# EAGLE schematic schematicEagle (EAGLE 9.6.2)
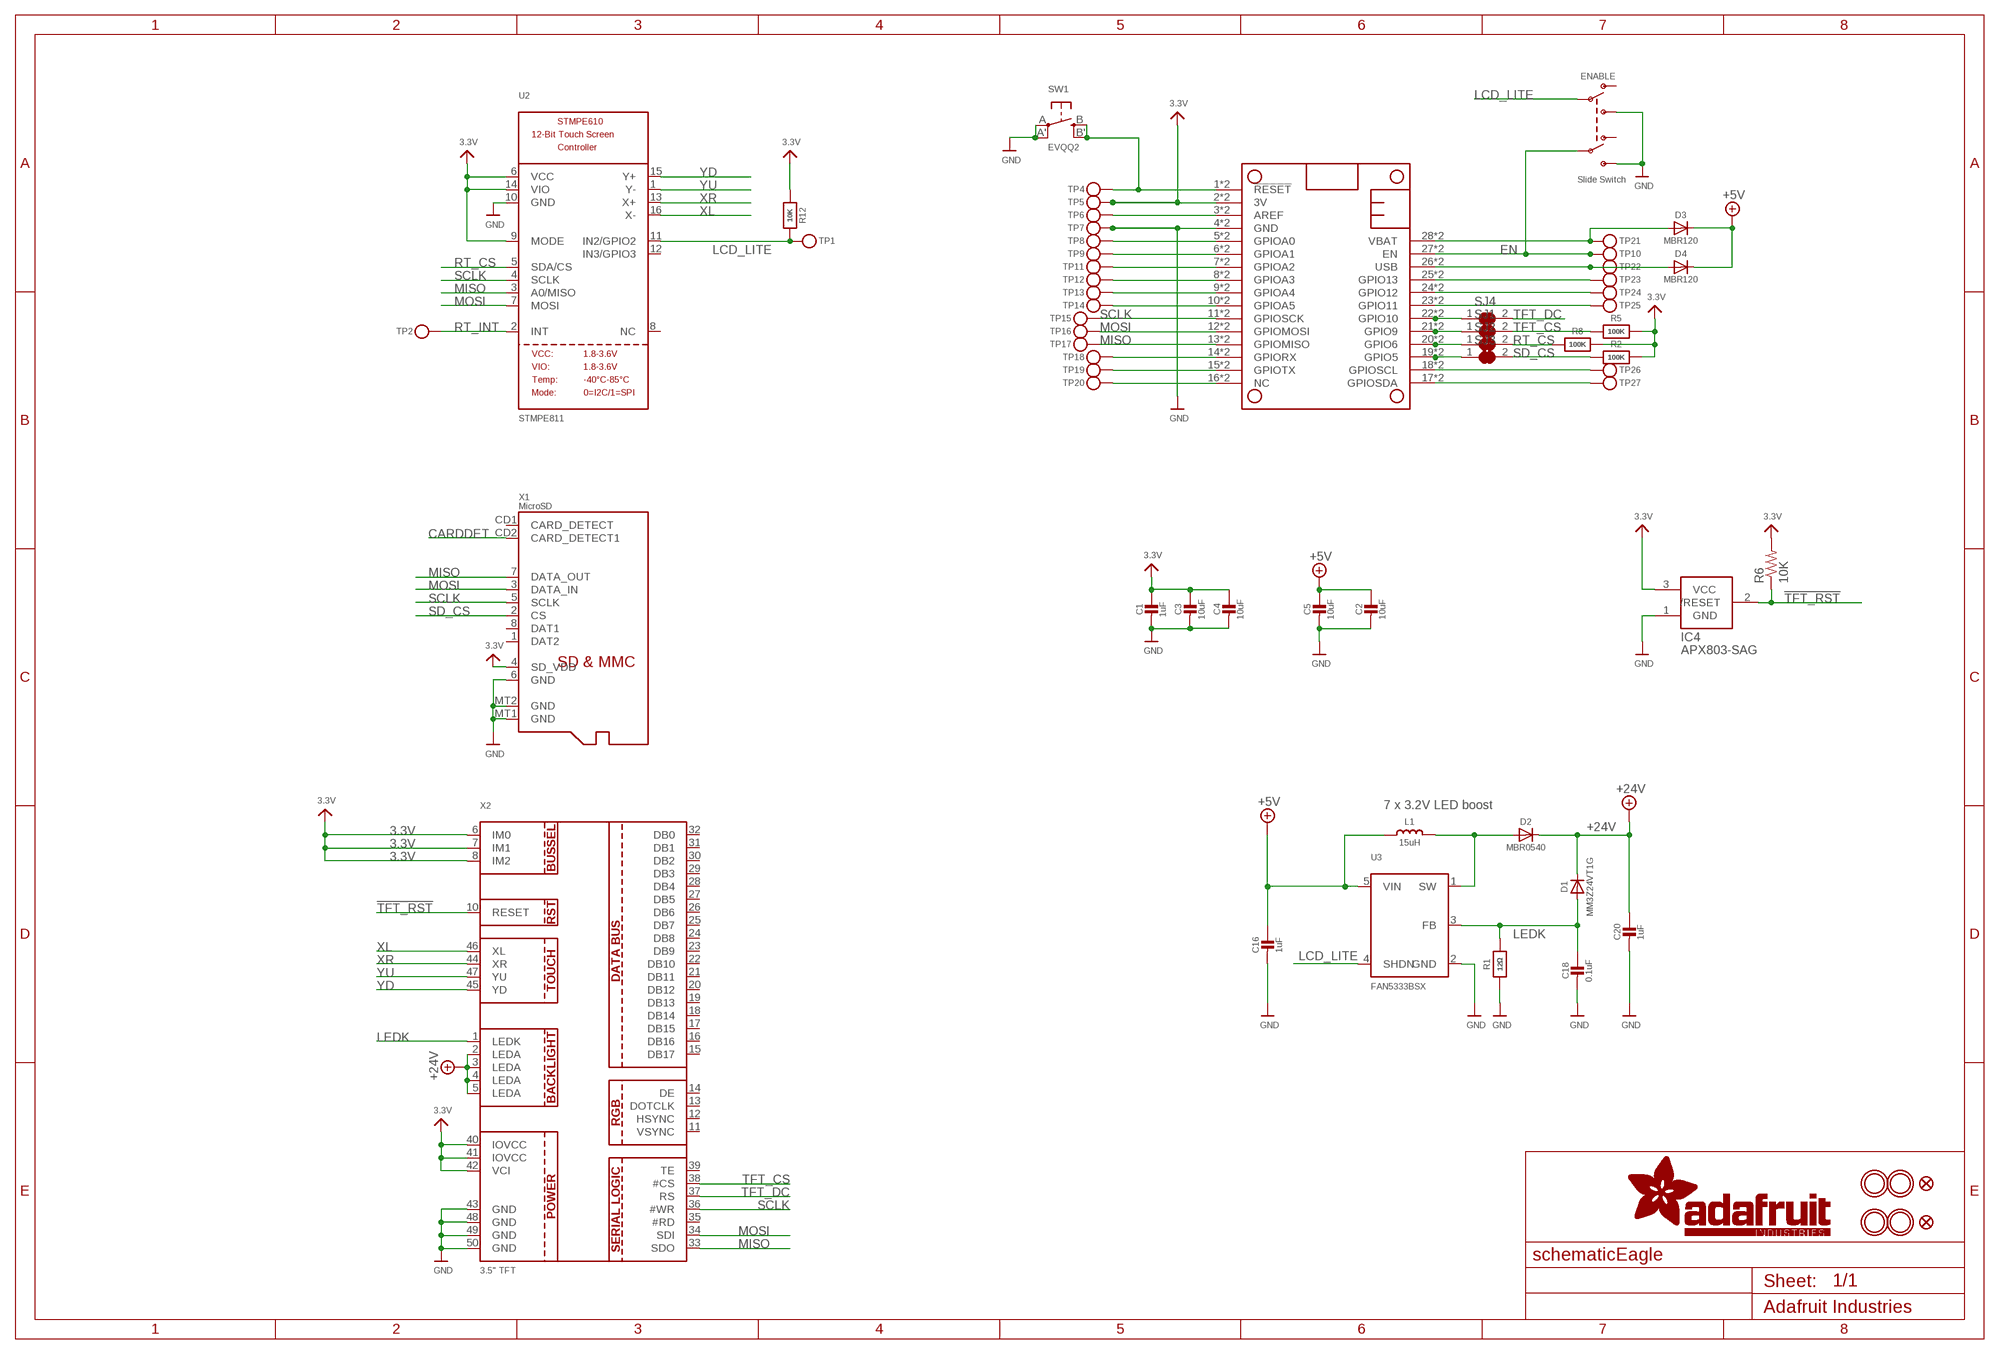
[diagram p0: schematic, sheet 1]

## Parts
C1  1uF  CAP_CERAMIC0805-NOOUTLINE  [0805-NO]
C2  10uF  CAP_CERAMIC0805-NOOUTLINE  [0805-NO]
C3  10uF  CAP_CERAMIC0805-NOOUTLINE  [0805-NO]
C4  10uF  CAP_CERAMIC0805-NOOUTLINE  [0805-NO]
C5  10uF  CAP_CERAMIC0805-NOOUTLINE  [0805-NO]
C16  1uF  CAP_CERAMIC0805-NOOUTLINE  [0805-NO]
C18  0.1uF  CAP_CERAMIC0805-NOOUTLINE  [0805-NO]
C20  1uF  CAP_CERAMIC0805-NOOUTLINE  [0805-NO]
D1  MM3Z24VT1G  DIODESMA  [SMADIODE]
D2  MBR0540  DIODESOD-123  [SOD-123]
D3  MBR120  DIODESOD-123  [SOD-123]
D4  MBR120  DIODESOD-123  [SOD-123]
ENABLE  Slide Switch  SWITCH_DPDTEG1390  [EG1390]
IC4  APX803-SAG  AXP083-SAG  [SOT23]
L1  15uH  INDUCTORNR5040  [INDUCTOR_5X5MM_NR5040_NOTHERMALS]
MS2  FEATHERWING_SMTDUAL  [FEATHERWING_SMT2]
R1  12Ω  RESISTOR0805_NOOUTLINE  [0805-NO]
R2  100K  RESISTOR0805_NOOUTLINE  [0805-NO]
R5  100K  RESISTOR0805_NOOUTLINE  [0805-NO]
R6  10K  R-US_R0805  [R0805]
R8  100K  RESISTOR0805_NOOUTLINE  [0805-NO]
R12  10K  RESISTOR0805_NOOUTLINE  [0805-NO]
SJ1  SOLDERJUMPER_CLOSED  [SOLDERJUMPER_CLOSEDWIRE]
SJ2  SOLDERJUMPER_CLOSED  [SOLDERJUMPER_CLOSEDWIRE]
SJ3  SOLDERJUMPER_CLOSED  [SOLDERJUMPER_CLOSEDWIRE]
SJ4  SOLDERJUMPER_CLOSED  [SOLDERJUMPER_CLOSEDWIRE]
SW1  EVQQ2  SWITCH_TACT_SMT_EVQQ2_SMALL  [EVQ-Q2_SMALLER]
TP1  TESTPOINTPAD2MM  [TESTPOINT_PAD_2MM]
TP2  TESTPOINTPAD2MM  [TESTPOINT_PAD_2MM]
TP4  TESTPOINTPAD2MM  [TESTPOINT_PAD_2MM]
TP5  TESTPOINTPAD2MM  [TESTPOINT_PAD_2MM]
TP6  TESTPOINTPAD2MM  [TESTPOINT_PAD_2MM]
TP7  TESTPOINTPAD2MM  [TESTPOINT_PAD_2MM]
TP8  TESTPOINTPAD2MM  [TESTPOINT_PAD_2MM]
TP9  TESTPOINTPAD2MM  [TESTPOINT_PAD_2MM]
TP10  TESTPOINTPAD2MM  [TESTPOINT_PAD_2MM]
TP11  TESTPOINTPAD2MM  [TESTPOINT_PAD_2MM]
TP12  TESTPOINTPAD2MM  [TESTPOINT_PAD_2MM]
TP13  TESTPOINTPAD2MM  [TESTPOINT_PAD_2MM]
TP14  TESTPOINTPAD2MM  [TESTPOINT_PAD_2MM]
TP15  TESTPOINTPAD2MM  [TESTPOINT_PAD_2MM]
TP16  TESTPOINTPAD2MM  [TESTPOINT_PAD_2MM]
TP17  TESTPOINTPAD2MM  [TESTPOINT_PAD_2MM]
TP18  TESTPOINTPAD2MM  [TESTPOINT_PAD_2MM]
TP19  TESTPOINTPAD2MM  [TESTPOINT_PAD_2MM]
TP20  TESTPOINTPAD2MM  [TESTPOINT_PAD_2MM]
TP21  TESTPOINTPAD2MM  [TESTPOINT_PAD_2MM]
TP22  TESTPOINTPAD2MM  [TESTPOINT_PAD_2MM]
TP23  TESTPOINTPAD2MM  [TESTPOINT_PAD_2MM]
TP24  TESTPOINTPAD2MM  [TESTPOINT_PAD_2MM]
TP25  TESTPOINTPAD2MM  [TESTPOINT_PAD_2MM]
TP26  TESTPOINTPAD2MM  [TESTPOINT_PAD_2MM]
TP27  TESTPOINTPAD2MM  [TESTPOINT_PAD_2MM]
U2  STMPE811  STMPE610  [QFN16_3MM]
U3  FAN5333BSX  FAN5331  [SOT23-5@1]
U$7  MOUNTINGHOLE3.0THIN  [MOUNTINGHOLE_3.0_PLATEDTHIN]
U$9  FIDUCIAL_1MM  [FIDUCIAL_1MM]
U$15  MOUNTINGHOLE3.0THIN  [MOUNTINGHOLE_3.0_PLATEDTHIN]
U$16  MOUNTINGHOLE3.0THIN  [MOUNTINGHOLE_3.0_PLATEDTHIN]
U$17  MOUNTINGHOLE3.0THIN  [MOUNTINGHOLE_3.0_PLATEDTHIN]
U$23  FIDUCIAL_1MM  [FIDUCIAL_1MM]
X1  MicroSD  MICROSD  [MICROSD]
X2  3.5" TFT  DISP_LCD_3.5IN_320X480_50PIN  [TFT_3.5IN_320X480_50PIN]

## Nets
3.3V: C1.1 C3.1 C4.1 IC4.3(VCC) MS2.2'(3V) MS2.2(3V) R2.2 R5.2 R6.2 R8.2 R12.1 TP5.P$1 U2.6(VCC) U2.9(MODE) U2.14(VIO) X1.4(SD_VDD) X2.6(IM0) X2.7(IM1) X2.8(IM2) X2.40(IOVCC) X2.41(IOVCC) X2.42(VCI)
!RESET: MS2.1'(!RESET) MS2.1(!RESET) SW1.B'(S1) SW1.B(S) TP4.P$1
!TFT_RST: IC4.2(/RESET) R6.1 X2.10(RESET)
+5V: C2.1 C5.1 C16.1 D3.C D4.C L1.P$1 U3.5(VIN)
+24V: C20.1 D1.C D2.C X2.2(LEDA) X2.3(LEDA) X2.4(LEDA) X2.5(LEDA)
A: MS2.5'(GPIOA0) MS2.5(GPIOA0) TP8.P$1
AREF: MS2.3'(AREF) MS2.3(AREF) TP6.P$1
B: MS2.6'(GPIOA1) MS2.6(GPIOA1) TP9.P$1
C: MS2.7'(GPIOA2) MS2.7(GPIOA2) TP11.P$1
CARDDET: X1.CD2(CARD_DETECT1)
D: MS2.8'(GPIOA3) MS2.8(GPIOA3) TP12.P$1
E: MS2.9'(GPIOA4) MS2.9(GPIOA4) TP13.P$1
EN: ENABLE.P2 MS2.27'(EN) MS2.27(EN) TP10.P$1
F: MS2.10'(GPIOA5) MS2.10(GPIOA5) TP14.P$1
G: MS2.16'(NC) MS2.16(NC) TP20.P$1
GND: C1.2 C2.2 C3.2 C4.2 C5.2 C16.2 C18.2 C20.2 ENABLE.S1 ENABLE.S2 IC4.1(GND) MS2.4'(GND) MS2.4(GND) R1.1 SW1.A'(P1) SW1.A(P) TP7.P$1 U2.10(GND) U3.2(GND) X1.6(GND) X1.MT1(GND) X1.MT2(GND) X2.43(GND) X2.48(GND) X2.49(GND) X2.50(GND)
H: MS2.19'(GPIO5) MS2.19(GPIO5) SJ3.1
I: MS2.20'(GPIO6) MS2.20(GPIO6) SJ2.1
J: MS2.21'(GPIO9) MS2.21(GPIO9) SJ1.1
K: MS2.22'(GPIO10) MS2.22(GPIO10) SJ4.1
L: MS2.23'(GPIO11) MS2.23(GPIO11) TP25.P$1
LCD_LITE: ENABLE.P1 R12.2 TP1.P$1 U2.11(IN2/GPIO2) U3.4(SHDN)
LEDK: C18.1 D1.A R1.2 U3.3(FB) X2.1(LEDK)
M: MS2.24'(GPIO12) MS2.24(GPIO12) TP24.P$1
MISO: MS2.13'(GPIOMISO) MS2.13(GPIOMISO) TP17.P$1 U2.3(A0/MISO) X1.7(DATA_OUT) X2.33(SDO)
MOSI: MS2.12'(GPIOMOSI) MS2.12(GPIOMOSI) TP16.P$1 U2.7(MOSI) X1.3(DATA_IN) X2.34(SDI)
N: MS2.25'(GPIO13) MS2.25(GPIO13) TP23.P$1
N$3: D2.A L1.P$2 U3.1(SW)
RT_CS: R8.1 SJ2.2 U2.5(SDA/CS)
RT_INT: TP2.P$1 U2.2(INT)
RX: MS2.14'(GPIORX) MS2.14(GPIORX) TP18.P$1
SCL: MS2.18'(GPIOSCL) MS2.18(GPIOSCL) TP26.P$1
SCLK: MS2.11'(GPIOSCK) MS2.11(GPIOSCK) TP15.P$1 U2.4(SCLK) X1.5(SCLK) X2.36(#WR)
SD_CS: R2.1 SJ3.2 X1.2(CS)
SDA: MS2.17'(GPIOSDA) MS2.17(GPIOSDA) TP27.P$1
TFT_CS: R5.1 SJ1.2 X2.38(#CS)
TFT_DC: SJ4.2 X2.37(RS)
TX: MS2.15'(GPIOTX) MS2.15(GPIOTX) TP19.P$1
USB: D4.A MS2.26'(USB) MS2.26(USB) TP22.P$1
VBAT: D3.A MS2.28'(VBAT) MS2.28(VBAT) TP21.P$1
XL: U2.16(X-) X2.46(XL)
XR: U2.13(X+) X2.44(XR)
YD: U2.15(Y+) X2.45(YD)
YU: U2.1(Y-) X2.47(YU)
Unconnected: ENABLE.O1 ENABLE.O2 U2.8(NC) U2.12(IN3/GPIO3) X1.1(DAT2) X1.8(DAT1) X1.CD1(CARD_DETECT) X2.11(VSYNC) X2.12(HSYNC) X2.13(DOTCLK) X2.14(DE) X2.15(DB17) X2.16(DB16) X2.17(DB15) X2.18(DB14) X2.19(DB13) X2.20(DB12) X2.21(DB11) X2.22(DB10) X2.23(DB9) X2.24(DB8) X2.25(DB7) X2.26(DB6) X2.27(DB5) X2.28(DB4) X2.29(DB3) X2.30(DB2) X2.31(DB1) X2.32(DB0) X2.35(#RD) X2.39(TE)

## Notes on the sheet
- 7 x 3.2V LED boost

## Library data of the parts
C1-C5 C16 C18 C20 = microbuilder:CAP_CERAMIC: Ceramic Capacitors For new designs, use the packages preceded by an '_' character since they are more reliable: The following footprints should be used on most boards: _0402 - Standard footprint for regular board layouts _0603 - Standard footprint for regular board layouts _0805 - Standard footprint for regular board layouts _1206 - Standard footprint for regular board layouts For extremely tight-pitch boards where space is at a premium, the following 'micro-pitch' footprints can be used (smaller pads, no silkscreen outline, etc.): _0402MP - Micro-pitch footprint for very dense/compact boards _0603MP - Micro-pitch footprint for very dense/compact boards _0805MP - Micro-pitch footprint for very dense/compact boards _1206MP - Micro-pitch footprint for very dense/compact boards
D1-D4 = microbuilder:DIODE: Diode SMA Model Volts Amps Type Vf Ir Digikey # Notes SSA34-E3 40V 3A Schottky 480mV @ 3A 200uA @ 40V SSA34-E3/61TGITR-ND CDBA120-G 20V 1A Schottky 500mV @ 1A 500uA @ 20V 641-1014-6-ND REEL MBRA210 10V 2A Schottky 350mV @ 2A 700uA @ 10V MBRA210LT3 SOD-123 Model Volts Amps Type Vf Ir Order # Notes BAT54T1G 30V 200mA Schottky 800mV @ 200mA 2uA @ 25V BAT54T1GOSTR-ND B0530W 30V 500mA Schottky 430mV @ 500mA 130uA @ 30V B0530W-FDICT-ND REEL MBR120 20V 1A Schottky 340mV @ 1A MBR120VLSFT1GOSCT-ND SOD-323 Model Volts Amps Type Vf Ir Order # Notes PMEG2005EJ 20V 500mA Schottky 355mV @ 500mA 568-4110-1-ND ZLLS410 10V 570mA Schottky 380mV @ 570mA ZLLS410CT-ND 1N4148WS 75V 150mA Silicon/Simple 1V 1N4148WSFSCT-ND REEL SOD-523 Model Volts Amps Type Vf Ir Order # Notes BAT54XV2 30V 200mA Schottky 0.8V @ 100mA BAT54XV2CT-ND TB751S 30V 30mA Schottky RB751S-40TE61CT-ND SOT23-R/W (R = Solder Paste/Reflow Ovens, W = Hand-Soldering) Model Volts Amps Type Vf Ir Order # Notes BAT54FILM 40V 300mA Schottky 497-7162-1-ND POWERDI-5 Model Volts Amps Type Vf Ir Order # Notes PDS560 60V 5A Schottky 670mV @ 5A 150uA @ 60V PDS560DICT-ND
ENABLE = microbuilder:SWITCH_DPDT: Switch - DPDT A DPDT Switch acts like an SPDT switch, but has a pair of switches instead of just one. Vertical - 0.3A @ 6V SMT - Digikey: JS202011SCQN
IC4 = adafruit:AXP083
L1 = microbuilder:INDUCTOR: Inductors 0603: 10nH Ceramic Inductor - microwire antenna/RF (Digikey: 712-1434-2-ND) 0805: 560nH Ceramic Inductor - RF (Digikey: 553-1047-1-ND) 270nH Ceramic Inductor - Q = 40@250MHz, +-5%, 1 Ohm DC Resistance (Digikey: 535-10506-2-ND) 1007 (2518 Metric) SMT: 10µH 10% 250mOhm 820mA 1007 Inductor (Digikey: 587-2189-1-ND) 22µH 10% 500mOhm 580mA 1007 Inductor (Digikey: 587-2190-1-ND) 47µH 10% 950mOhm 420mA 1007 Inductor (Digikey: 587-2191-1-ND) 47µH 5% 100mOhm 1A 1008 Inductor (Digikey: 732-1816-1-ND) 5.0x5.0mm (Taiyo Yuden NR5040 Series) 6.8µH 20% 2.3A 64mOhm Inductor (Digikey: 587-2374-2-ND) 5.0x5.0mm (TDK VLC5045 Series) 4.7µH 20% 3.3A 34mOhm Inductor (Digikey: 445-6526-1-ND) 6.8µH 20% 2.7A 46mOhm Inductor (Digikey: 445-6527-1-ND) 6.0x6.0mm (TDK VLC6045 Series) 4.7µH 20% 3.8A 27mOhm Inductor (Digikey: 445-6538-2-ND) 6.8µH 20% 3A 41mOhm Inductor (Digikey: 445-6540-1-ND) 6.2µH 30% 2.2A 45mOhm Inductor (Digikey: SRR5028-6R2YCT-ND) - Not TDK VLC6045 but footprint should match 6.0x6.0mm (TDK SLF6045 Series) 6.8uH 30% 2A 33mOhm Inductor (Digikey: 445-4572-1-ND, Mouser: 810-SLF645T6R8N2R0PF) 6.0x6.0mm (Sumida CDRH5D28 Series) 6.2uH 30% 1.8A 45mOhm Inductor (Digikey: 308-1542-1-ND) Taiyo Yuden NR3015T2R2M - 2.2uH 20% 1.5A (Digikey: 587-1648-2-ND, Mouser: 963-NR3015T2R2M) - Used with TI TPS62172 CoilCraft RFID Transponder Coil - MA5532-AE (For use with AS3935 Lightning Sensor) Taiyo Yuden NRH2412T2R2MNGH - 2.2uH 20% 1AA (Digikey: 587-3443-1-ND) - Used with TI LM3671 Vishay IHLP 1.0uH Molded Inductor - 24mOhm DCR, 5A, +/-20%, -55°C-125°C (Digikey: 541-1319-1-ND)
MS2 = microbuilder:FEATHERWING
R1 R2 R5 R8 R12 = microbuilder:RESISTOR: Resistors For new designs, use the packages preceded by an '_' character since they are more reliable: The following footprints should be used on most boards: _0402 - Standard footprint for regular board layouts _0603 - Standard footprint for regular board layouts _0805 - Standard footprint for regular board layouts _1206 - Standard footprint for regular board layouts For extremely tight-pitch boards where space is at a premium, the following 'micro-pitch' footprints can be used (smaller pads, no silkscreen outline, etc.): _0402MP - Micro-pitch footprint for very dense/compact boards _0603MP - Micro-pitch footprint for very dense/compact boards _0805MP - Micro-pitch footprint for very dense/compact boards _1206MP - Micro-pitch footprint for very dense/compact boards
R6 = rcl:R-US_: RESISTOR, American symbol
SJ1-SJ4 = microbuilder:SOLDERJUMPER_CLOSED: Solder Jumper - Closed These solder jumpers are closed by default CLOSEDWIRE - 10 mil trace between pads that can be cut and resoldered later CLOSEDPERM - 63 mil trace between pads for a permanent connection (used to 'bridge' two signals, a shameless hack for Eagle). Can double as a test point as well (no cream layer)
SW1 = microbuilder:SWITCH_TACT_SMT: SMT Tact Switches 6x6mm - Digikey: P12940SCT-ND KMR2 (4.6x2.8mm) - Digikey: 401-1426-1-ND EVQ-PQHB55 - Light Touch, 160GF (4.5x4.5mm) - Digikey: P8090SCT-ND KMT0 - KMT021 NGJ LHS (etc.) IP68/Waterproof - Digikey: CKN10289CT-ND
TP1 TP2 TP4-TP27 = microbuilder:TESTPOINT: Test Point Various test points for characterisation and PCB testing TESTPOINT_SMT - Compact Surface Mount Test Point [Digikey: 5016KTR-ND]
U2 = microbuilder:STMPE610: STMPE610 - 12-Bit Touch Screen Controller
U3 = microbuilder:FAN5331: FAN5331 - LED/OLED 20V Boost Converter Digikey: FAN5331SXCT-ND
U$7 U$15-U$17 = microbuilder:MOUNTINGHOLE: Mounting Hole For #2 screws (0.086"/2.18mm width, 0.094"/2.4mm hole) use 2.5mm; BOM: EXCLUDE
U$9 U$23 = microbuilder:FIDUCIAL: Fiducial Alignment Points Various fiducial points for machine vision alignment.; BOM: EXCLUDE
X1 = microbuilder:MICROSD: MicroSD/Transflash Card Holder with SPI pinout 3M: 2908-05WB-MG 4UConnector: 19656 Footprint courtesy: Adafruit Industries
X2 = microbuilder:DISP_LCD_3.5IN_320X480_50PIN: DT350HV15-T - 3.5" 320x480 TFT Display, 50 Pin Connector